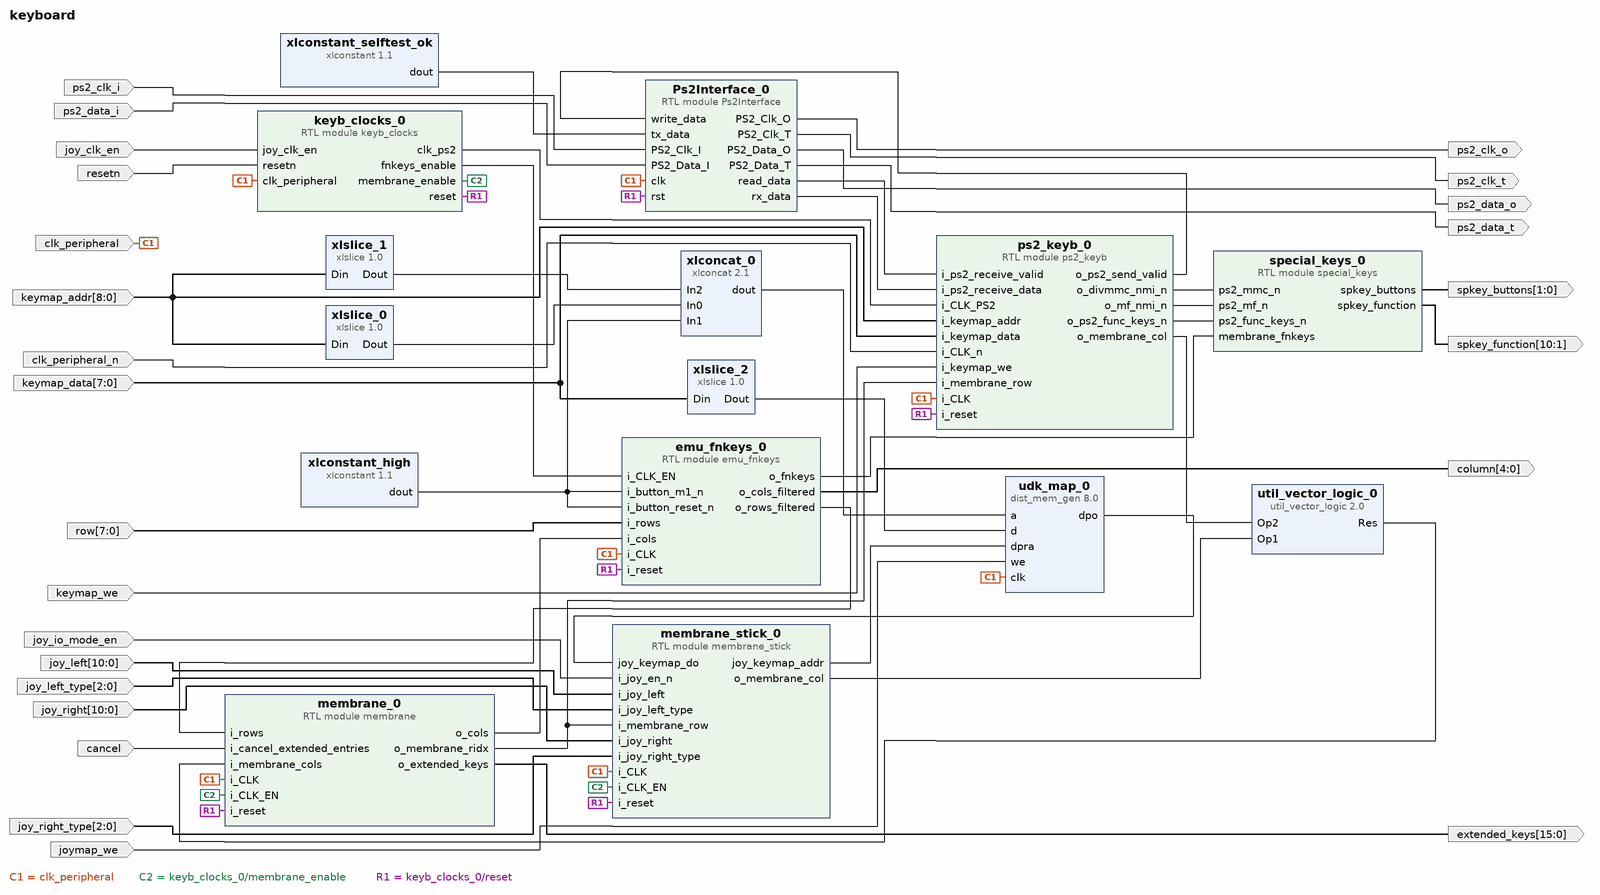
[diagram p0: block diagram of the top level]
# Vivado block design keyboard, xc7a100tcsg324-1, Vivado 2021.2.1
create_bd_design keyboard

create_bd_port -dir I cancel
create_bd_port -dir I -type clk clk_peripheral
set_property -dict {CONFIG.FREQ_HZ 28000000} [get_bd_ports clk_peripheral]
create_bd_port -dir I -type clk clk_peripheral_n
set_property -dict {CONFIG.FREQ_HZ 28000000} [get_bd_ports clk_peripheral_n]
create_bd_port -dir O -from 4 -to 0 column
create_bd_port -dir O -from 15 -to 0 extended_keys
create_bd_port -dir I -from 8 -to 0 keymap_addr
create_bd_port -dir I -from 7 -to 0 keymap_data
create_bd_port -dir I keymap_we
create_bd_port -dir I ps2_clk_i
create_bd_port -dir O ps2_clk_o
create_bd_port -dir O ps2_clk_t
create_bd_port -dir I ps2_data_i
create_bd_port -dir O ps2_data_o
create_bd_port -dir O ps2_data_t
create_bd_port -dir I -from 7 -to 0 row
create_bd_port -dir O -from 1 -to 0 spkey_buttons
create_bd_port -dir O -from 10 -to 1 spkey_function
create_bd_port -dir I joymap_we
create_bd_port -dir I joy_io_mode_en
create_bd_port -dir I -from 2 -to 0 joy_left_type
create_bd_port -dir I -from 2 -to 0 joy_right_type
create_bd_port -dir I -from 10 -to 0 joy_right
create_bd_port -dir I -from 10 -to 0 joy_left
create_bd_port -dir I -type ce joy_clk_en
create_bd_port -dir I -type rst resetn

create_bd_cell -type module -reference Ps2Interface Ps2Interface_0
set_property -dict [list \
  CONFIG.DEBOUNCE_DELAY {"0010001"} \
  CONFIG.DELAY_100US {"00101011110000"} \
  CONFIG.DELAY_20US {"01000110000"} \
  CONFIG.DELAY_63CLK {"0010001"} \
] [get_bd_cells Ps2Interface_0]
create_bd_cell -type module -reference emu_fnkeys emu_fnkeys_0
create_bd_cell -type module -reference membrane membrane_0
create_bd_cell -type module -reference ps2_keyb ps2_keyb_0
set_property -dict {CONFIG.CLK_KHZ 218} [get_bd_cells ps2_keyb_0]
create_bd_cell -type module -reference special_keys special_keys_0
create_bd_cell -type ip -vlnv xilinx.com:ip:xlconstant:1.1 xlconstant_high
create_bd_cell -type ip -vlnv xilinx.com:ip:xlconstant:1.1 xlconstant_selftest_ok
set_property -dict {CONFIG.CONST_VAL 0x55 CONFIG.CONST_WIDTH 8} [get_bd_cells xlconstant_selftest_ok]
create_bd_cell -type ip -vlnv xilinx.com:ip:xlslice:1.0 xlslice_0
set_property -dict {CONFIG.DIN_FROM 3 CONFIG.DIN_WIDTH 9 CONFIG.DOUT_WIDTH 4} [get_bd_cells xlslice_0]
create_bd_cell -type ip -vlnv xilinx.com:ip:xlslice:1.0 xlslice_1
set_property -dict {CONFIG.DIN_FROM 4 CONFIG.DIN_TO 4 CONFIG.DIN_WIDTH 9 CONFIG.DOUT_WIDTH 1} [get_bd_cells xlslice_1]
create_bd_cell -type ip -vlnv xilinx.com:ip:util_vector_logic:2.0 util_vector_logic_0
set_property -dict {CONFIG.C_SIZE 7} [get_bd_cells util_vector_logic_0]
create_bd_cell -type ip -vlnv xilinx.com:ip:dist_mem_gen:8.0 udk_map_0
set_property -dict [list \
  CONFIG.coefficient_file ../../../../imports/ZXNext/ram/init/keyjoy_64_6.coe \
  CONFIG.data_width 6 \
  CONFIG.default_data_radix 10 \
  CONFIG.input_options non_registered \
  CONFIG.memory_type simple_dual_port_ram \
  CONFIG.output_options non_registered \
  CONFIG.simple_dual_port_address non_registered \
  CONFIG.simple_dual_port_output_clock_enable false \
] [get_bd_cells udk_map_0]
create_bd_cell -type ip -vlnv xilinx.com:ip:xlslice:1.0 xlslice_2
set_property -dict {CONFIG.DIN_FROM 5 CONFIG.DIN_WIDTH 8 CONFIG.DOUT_WIDTH 6} [get_bd_cells xlslice_2]
create_bd_cell -type ip -vlnv xilinx.com:ip:xlconcat:2.1 xlconcat_0
set_property -dict {CONFIG.NUM_PORTS 3} [get_bd_cells xlconcat_0]
create_bd_cell -type module -reference membrane_stick membrane_stick_0
create_bd_cell -type module -reference keyb_clocks keyb_clocks_0

# ---- connections ----

connect_bd_net [get_bd_pins Ps2Interface_0/PS2_Clk_O] [get_bd_ports ps2_clk_o]
connect_bd_net [get_bd_pins Ps2Interface_0/PS2_Clk_T] [get_bd_ports ps2_clk_t]
connect_bd_net [get_bd_pins Ps2Interface_0/PS2_Data_O] [get_bd_ports ps2_data_o]
connect_bd_net [get_bd_pins Ps2Interface_0/PS2_Data_T] [get_bd_ports ps2_data_t]
connect_bd_net [get_bd_pins Ps2Interface_0/read_data] [get_bd_pins ps2_keyb_0/i_ps2_receive_valid]
connect_bd_net [get_bd_pins Ps2Interface_0/rx_data] [get_bd_pins ps2_keyb_0/i_ps2_receive_data]
connect_bd_net [get_bd_ports cancel] [get_bd_pins membrane_0/i_cancel_extended_entries]
connect_bd_net [get_bd_ports clk_peripheral] \
  [get_bd_pins Ps2Interface_0/clk] [get_bd_pins emu_fnkeys_0/i_CLK] [get_bd_pins membrane_0/i_CLK] \
  [get_bd_pins ps2_keyb_0/i_CLK] [get_bd_pins udk_map_0/clk] [get_bd_pins membrane_stick_0/i_CLK] \
  [get_bd_pins keyb_clocks_0/clk_peripheral]
connect_bd_net [get_bd_ports clk_peripheral_n] [get_bd_pins ps2_keyb_0/i_CLK_n]
connect_bd_net -net dist_mem_gen_0_dpo [get_bd_pins udk_map_0/dpo] [get_bd_pins membrane_stick_0/joy_keymap_do]
connect_bd_net [get_bd_pins emu_fnkeys_0/o_cols_filtered] [get_bd_ports column]
connect_bd_net [get_bd_pins emu_fnkeys_0/o_fnkeys] [get_bd_pins special_keys_0/membrane_fnkeys]
connect_bd_net [get_bd_pins emu_fnkeys_0/o_rows_filtered] [get_bd_pins membrane_0/i_rows]
connect_bd_net [get_bd_ports joy_clk_en] [get_bd_pins keyb_clocks_0/joy_clk_en]
connect_bd_net [get_bd_ports joy_io_mode_en] [get_bd_pins membrane_stick_0/i_joy_en_n]
connect_bd_net [get_bd_ports joy_left] [get_bd_pins membrane_stick_0/i_joy_left]
connect_bd_net [get_bd_ports joy_left_type] [get_bd_pins membrane_stick_0/i_joy_left_type]
connect_bd_net [get_bd_ports joy_right] [get_bd_pins membrane_stick_0/i_joy_right]
connect_bd_net [get_bd_ports joy_right_type] [get_bd_pins membrane_stick_0/i_joy_right_type]
connect_bd_net [get_bd_ports joymap_we] [get_bd_pins udk_map_0/we]
connect_bd_net [get_bd_pins keyb_clocks_0/clk_ps2] [get_bd_pins ps2_keyb_0/i_CLK_PS2]
connect_bd_net [get_bd_pins keyb_clocks_0/fnkeys_enable] [get_bd_pins emu_fnkeys_0/i_CLK_EN]
connect_bd_net [get_bd_pins keyb_clocks_0/membrane_enable] [get_bd_pins membrane_0/i_CLK_EN] [get_bd_pins membrane_stick_0/i_CLK_EN]
connect_bd_net [get_bd_ports keymap_addr] [get_bd_pins ps2_keyb_0/i_keymap_addr] [get_bd_pins xlslice_0/Din] [get_bd_pins xlslice_1/Din]
connect_bd_net [get_bd_ports keymap_data] [get_bd_pins ps2_keyb_0/i_keymap_data] [get_bd_pins xlslice_2/Din]
connect_bd_net [get_bd_ports keymap_we] [get_bd_pins ps2_keyb_0/i_keymap_we]
connect_bd_net [get_bd_pins membrane_0/o_cols] [get_bd_pins emu_fnkeys_0/i_cols]
connect_bd_net [get_bd_pins membrane_0/o_extended_keys] [get_bd_ports extended_keys]
connect_bd_net [get_bd_pins membrane_0/o_membrane_ridx] [get_bd_pins ps2_keyb_0/i_membrane_row] [get_bd_pins membrane_stick_0/i_membrane_row]
connect_bd_net [get_bd_pins membrane_stick_0/joy_keymap_addr] [get_bd_pins udk_map_0/dpra]
connect_bd_net [get_bd_pins membrane_stick_0/o_membrane_col] [get_bd_pins util_vector_logic_0/Op1]
connect_bd_net [get_bd_ports ps2_clk_i] [get_bd_pins Ps2Interface_0/PS2_Clk_I]
connect_bd_net [get_bd_ports ps2_data_i] [get_bd_pins Ps2Interface_0/PS2_Data_I]
connect_bd_net [get_bd_pins ps2_keyb_0/o_divmmc_nmi_n] [get_bd_pins special_keys_0/ps2_mmc_n]
connect_bd_net [get_bd_pins ps2_keyb_0/o_membrane_col] [get_bd_pins util_vector_logic_0/Op2]
connect_bd_net [get_bd_pins ps2_keyb_0/o_mf_nmi_n] [get_bd_pins special_keys_0/ps2_mf_n]
connect_bd_net [get_bd_pins ps2_keyb_0/o_ps2_func_keys_n] [get_bd_pins special_keys_0/ps2_func_keys_n]
connect_bd_net [get_bd_pins ps2_keyb_0/o_ps2_send_valid] [get_bd_pins Ps2Interface_0/write_data]
connect_bd_net -net reset_1 [get_bd_pins keyb_clocks_0/reset] \
  [get_bd_pins Ps2Interface_0/rst] [get_bd_pins emu_fnkeys_0/i_reset] [get_bd_pins membrane_0/i_reset] \
  [get_bd_pins ps2_keyb_0/i_reset] [get_bd_pins membrane_stick_0/i_reset]
connect_bd_net [get_bd_ports resetn] [get_bd_pins keyb_clocks_0/resetn]
connect_bd_net [get_bd_ports row] [get_bd_pins emu_fnkeys_0/i_rows]
connect_bd_net [get_bd_pins special_keys_0/spkey_buttons] [get_bd_ports spkey_buttons]
connect_bd_net [get_bd_pins special_keys_0/spkey_function] [get_bd_ports spkey_function]
connect_bd_net [get_bd_pins util_vector_logic_0/Res] [get_bd_pins membrane_0/i_membrane_cols]
connect_bd_net [get_bd_pins xlconcat_0/dout] [get_bd_pins udk_map_0/a]
connect_bd_net -net xlconstant_high1_dout [get_bd_pins xlconstant_selftest_ok/dout] [get_bd_pins Ps2Interface_0/tx_data]
connect_bd_net [get_bd_pins xlconstant_high/dout] \
  [get_bd_pins emu_fnkeys_0/i_button_m1_n] [get_bd_pins emu_fnkeys_0/i_button_reset_n] [get_bd_pins xlconcat_0/In1]
connect_bd_net [get_bd_pins xlslice_0/Dout] [get_bd_pins xlconcat_0/In0]
connect_bd_net [get_bd_pins xlslice_1/Dout] [get_bd_pins xlconcat_0/In2]
connect_bd_net [get_bd_pins xlslice_2/Dout] [get_bd_pins udk_map_0/d]

validate_bd_design
save_bd_design
